# EAGLE schematic shield radio-comand (EAGLE 7.1.0)
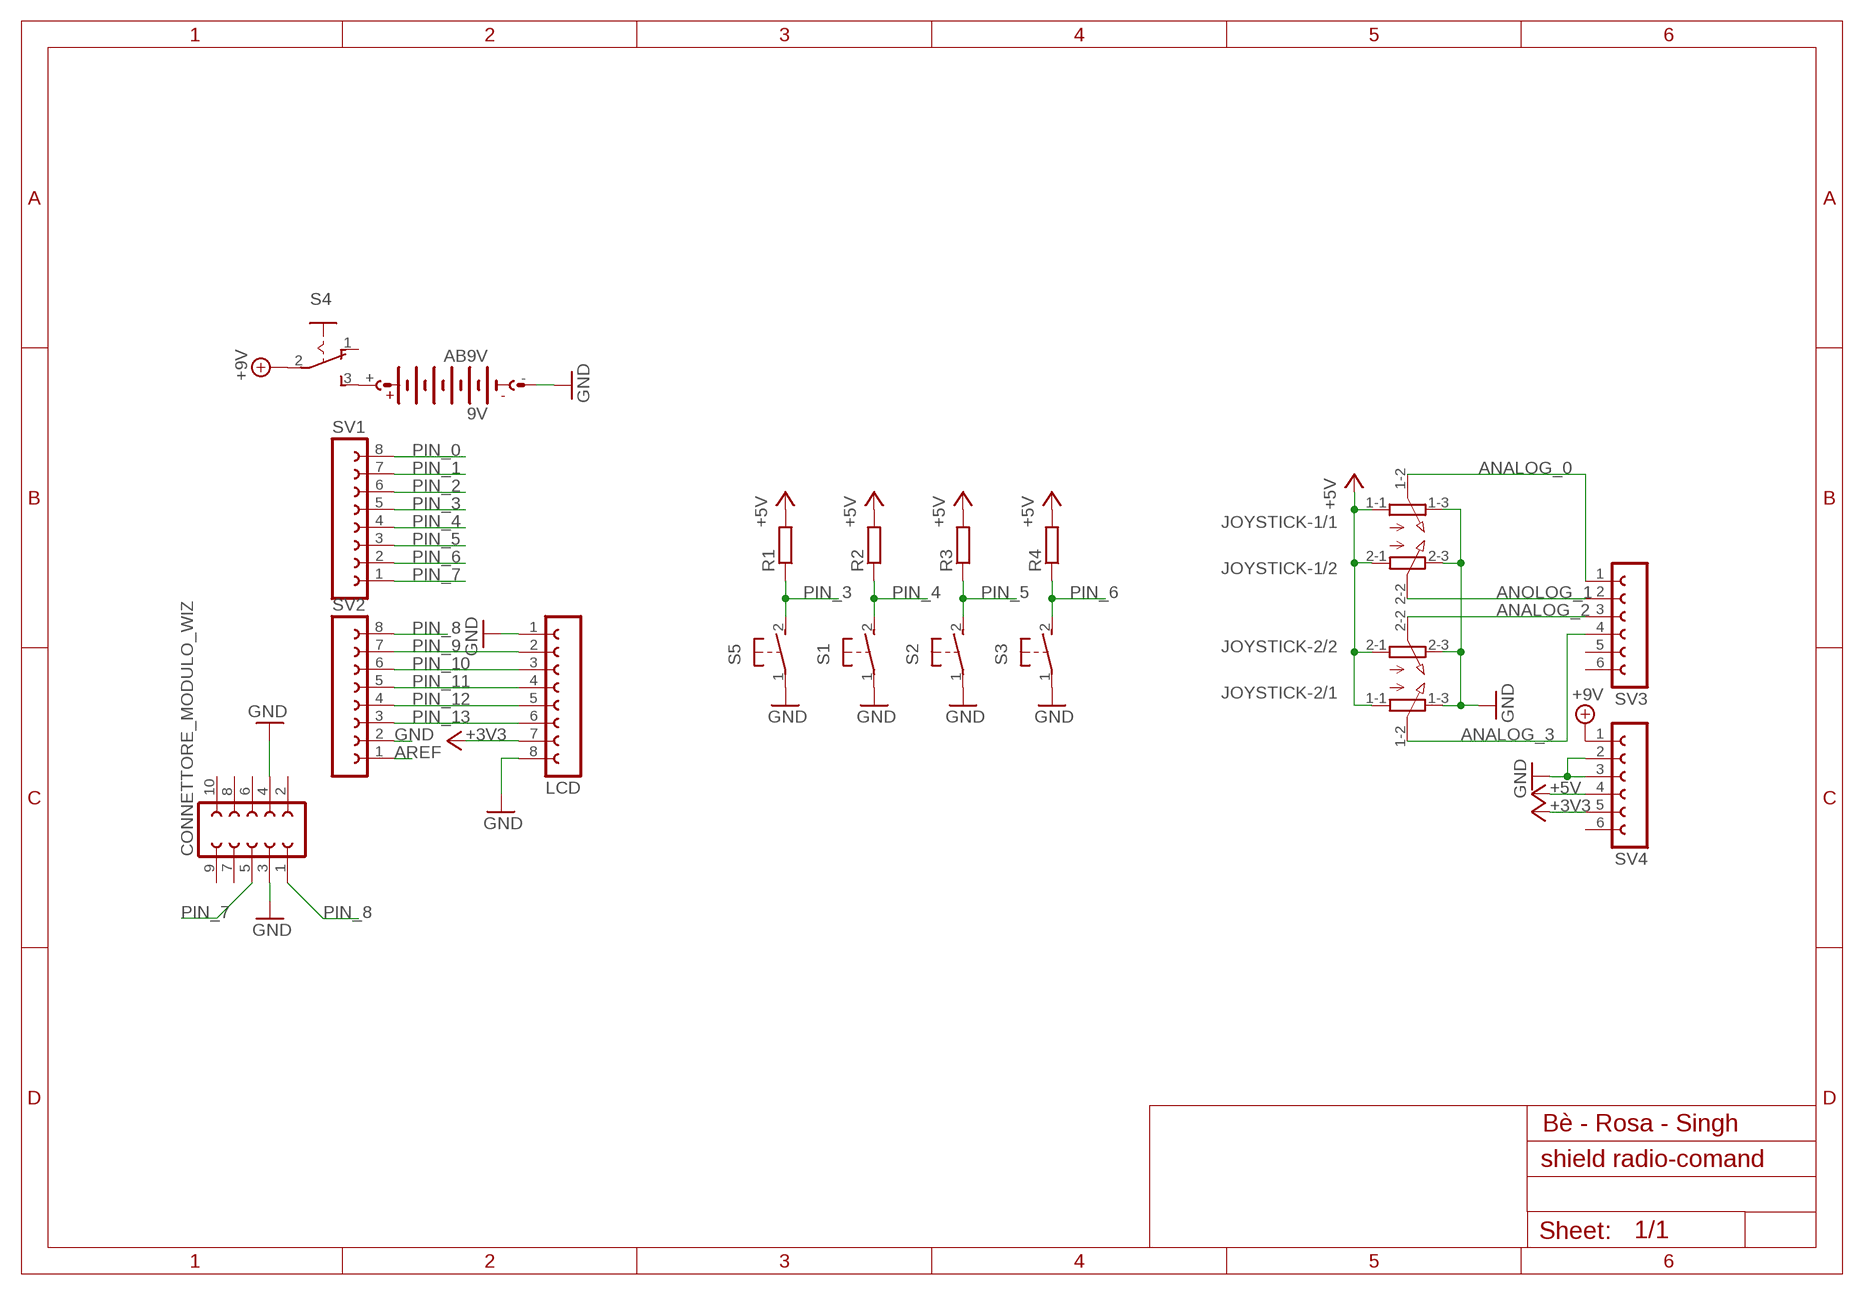
[diagram p0: schematic, sheet 1]

## Parts
9V  AB9V  [AB9V]
CONNETTORE_MODULO_WIZ  FE05-2  [FE05-2]
JOYSTICK-1  3RP/1610G  [3RP/1610G]
JOYSTICK-2  3RP/1610G  [3RP/1610G]
LCD  FE08-1  [FE08]
R1  R-EU_0207/10  [0207/10]
R2  R-EU_0207/10  [0207/10]
R3  R-EU_0207/10  [0207/10]
R4  R-EU_0207/10  [0207/10]
S1  31-XX  [B3F-31XX]
S2  31-XX  [B3F-31XX]
S3  31-XX  [B3F-31XX]
S4  255SB  [255SB]
S5  31-XX  [B3F-31XX]
SV1  FE08-1  [FE08]
SV2  FE08-1  [FE08]
SV3  FE06-1  [FE06]
SV4  FE06-1  [FE06]

## Nets
+3V3: LCD.7 SV4.5
+5V: JOYSTICK-1.1-1(/1:A) JOYSTICK-1.2-1(/2:A) JOYSTICK-2.1-1(/1:A) JOYSTICK-2.2-1(/2:A) R1.2 R2.2 R3.2 R4.2 SV4.4
+9V: S4.2(P) SV4.1
ANALOG_0: JOYSTICK-1.1-2(/1:S) SV3.1
ANALOG_2: JOYSTICK-2.2-2(/2:S) SV3.3
ANALOG_3: JOYSTICK-2.1-2(/1:S) SV3.4
ANOLOG_1: JOYSTICK-1.2-2(/2:S) SV3.2
AREF: SV2.1
GND: 9V.- CONNETTORE_MODULO_WIZ.3 CONNETTORE_MODULO_WIZ.4 JOYSTICK-1.1-3(/1:E) JOYSTICK-1.2-3(/2:E) JOYSTICK-2.1-3(/1:E) JOYSTICK-2.2-3(/2:E) LCD.1 LCD.8 S1.1(P) S2.1(P) S3.1(P) S5.1(P) SV2.2 SV4.2 SV4.3
N$1: 9V.+ S4.3(S)
PIN_0: SV1.8
PIN_1: SV1.7
PIN_2: SV1.6
PIN_3: R1.1 S5.2(S) SV1.5
PIN_4: R2.1 S1.2(S) SV1.4
PIN_5: R3.1 S2.2(S) SV1.3
PIN_6: R4.1 S3.2(S) SV1.2
PIN_7: CONNETTORE_MODULO_WIZ.5 SV1.1
PIN_8: CONNETTORE_MODULO_WIZ.1 SV2.8
PIN_9: LCD.2 SV2.7
PIN_10: LCD.3 SV2.6
PIN_11: LCD.4 SV2.5
PIN_12: LCD.5 SV2.4
PIN_13: LCD.6 SV2.3
Unconnected: CONNETTORE_MODULO_WIZ.2 CONNETTORE_MODULO_WIZ.6 CONNETTORE_MODULO_WIZ.7 CONNETTORE_MODULO_WIZ.8 CONNETTORE_MODULO_WIZ.9 CONNETTORE_MODULO_WIZ.10 S4.1(O) SV3.5 SV3.6 SV4.6

## Notes on the sheet
- Bè - Rosa - Singh

## Library data of the parts
9V = battery:AB9V: 9-V BATTERY CLIP
CONNETTORE_MODULO_WIZ = con-lsta:FE05-2: FEMALE HEADER; OC_FARNELL: unknown; OC_NEWARK: unknown
JOYSTICK-1 JOYSTICK-2 = pot:3RP/1610G: 16mm Potentiometer two level Source: http://www.alphapotentiometers.net/html/16mm_pot_2.html
LCD SV1 SV2 = con-lsta:FE08-1: FEMALE HEADER; OC_FARNELL: unknown; OC_NEWARK: unknown
R1-R4 = rcl:R-EU_: RESISTOR, European symbol
S1-S3 S5 = switch-omron:31-XX: OMRON SWITCH; MPN: B3F-3100; OC_FARNELL: 959704; OC_NEWARK: 36M3582
S4 = switch:255SB: SLIDING SWITCH Distributor Buerklin, 11G810
SV3 SV4 = con-lsta:FE06-1: FEMALE HEADER; OC_FARNELL: unknown; OC_NEWARK: unknown